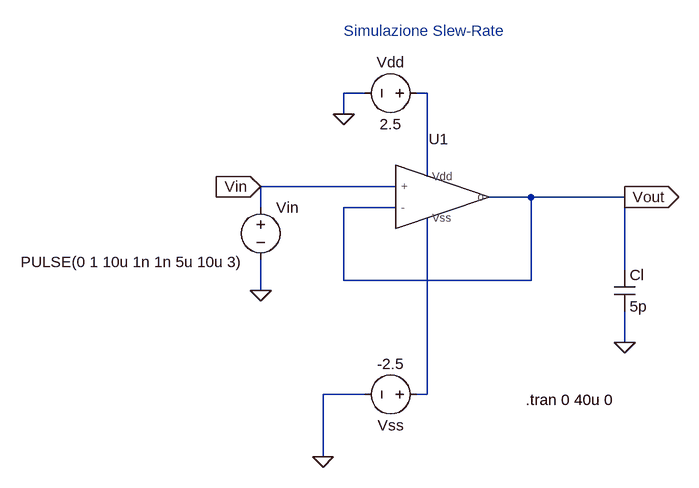
[diagram p0: schematic SR_Basic.asc]
SR_Basic.asc, the LTspice schematic file:
Version 4
SHEET 1 880 680
WIRE 0 -48 -32 -48
WIRE 96 -48 80 -48
WIRE -32 -16 -32 -48
WIRE 96 80 96 -48
WIRE 48 96 -160 96
WIRE 256 112 192 112
WIRE 400 112 256 112
WIRE -160 128 -160 96
WIRE 48 128 -32 128
WIRE 400 224 400 112
WIRE -32 240 -32 128
WIRE 256 240 256 112
WIRE 256 240 -32 240
WIRE -160 256 -160 208
WIRE 400 336 400 288
WIRE 0 416 -64 416
WIRE 96 416 96 144
WIRE 96 416 80 416
WIRE -64 512 -64 416
FLAG 400 336 0
FLAG -160 256 0
FLAG -32 -16 0
FLAG -64 512 0
FLAG -160 96 Vin
IOPIN -160 96 In
FLAG 400 112 Vout
IOPIN 400 112 Out
SYMBOL AutoGenerated\\OPAMPBASIC 112 112 R0
WINDOW 3 81 72 Invisible 2
WINDOW 0 2 -74 Bottom 2
SYMATTR InstName U1
SYMBOL cap 384 224 R0
SYMATTR InstName Cl
SYMATTR Value 5p
SYMBOL voltage -160 112 R0
WINDOW 123 0 0 Left 0
WINDOW 39 0 0 Left 0
WINDOW 3 -369 100 Left 2
SYMATTR Value PULSE(0 1 10u 1n 1n 5u 10u 3)
SYMATTR InstName Vin
SYMBOL voltage 96 -48 R90
WINDOW 0 -32 56 VBottom 2
WINDOW 3 32 56 VTop 2
SYMATTR InstName Vdd
SYMATTR Value 2.5
SYMBOL voltage 96 416 R90
WINDOW 0 32 56 VTop 2
WINDOW 3 -32 56 VBottom 2
WINDOW 123 0 0 Left 0
WINDOW 39 0 0 Left 0
SYMATTR InstName Vss
SYMATTR Value -2.5
TEXT -32 -144 Left 2 ;Simulazione Slew-Rate
TEXT 248 424 Left 2 !.tran 0 40u 0

The netlist it stands for:
* SR_Basic.asc
XU1 Vin Vout Vout N001 N002 OPAMPBASIC  ; pins + - o Vdd Vss
Cl Vout 0 5p
Vin Vin 0 PULSE(0 1 10u 1n 1n 5u 10u 3)
Vdd N001 0 2.5
Vss N002 0 -2.5
* Simulazione Slew-Rate
.tran 0 40u 0
.lib C:\Users\andre\Desktop\Universita\PrimoAnno\SecondoSemestre\ProgettiAnalogici\OpAmpProject\Basic\OpAmpBasic.cir
.backanno
.end